# EAGLE design Ring machine1 copia (EAGLE 7.2.0)
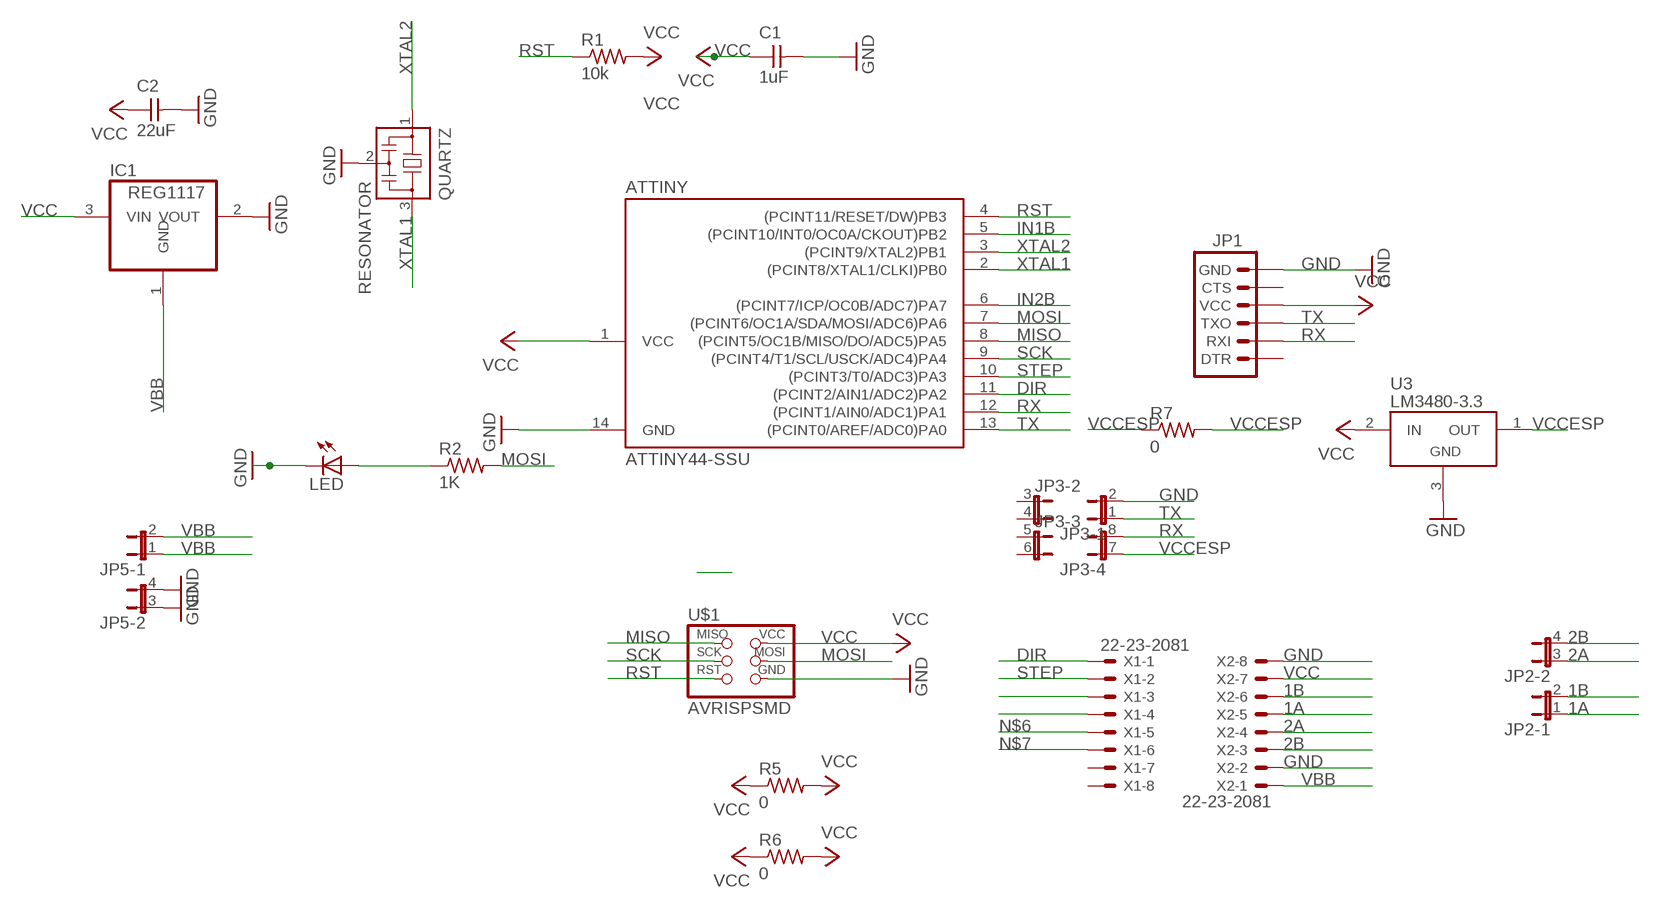
[diagram p0: schematic, sheet 1]

## Parts
ATTINY  ATTINY44-SSU  [SOIC14]
C1  1uF  UNPOLARIZED_CAPACITOR1206  [1206]
C2  22uF  UNPOLARIZED_CAPACITOR1206  [1206]
IC1  REG1117  [SOT223]
JP1  ARDUINO_SERIAL_PROGRAMLONGPADS  [1X06_LONGPADS]
JP2  JP2QE  [JP2Q]
JP3  JP4QE  [JP4Q]
JP5  JP2QE  [JP2Q]
LED  LED1206  [1206]
QUARTZ  RESONATOR  [EFOBM]
R1  10k  RESISTOR1206  [1206]
R2  1K  RESISTOR1206  [1206]
R5  0  RESISTOR1206  [1206]
R6  0  RESISTOR1206  [1206]
R7  0  RESISTOR1206  [1206]
U3  LM3480-3.3  [SOT-23-3]
U$1  AVRISPSMD  [2X03SMD]
X1  22-23-2081  [22-23-2081]
X2  22-23-2081  [22-23-2081]

## Nets
1A: JP2.1 X2.5
1B: JP2.2 X2.6
2A: JP2.3 X2.4
2B: JP2.4 X2.3
DIR: ATTINY.11((PCINT2/AIN1/ADC2)PA2) X1.1
GND: ATTINY.14(GND) C1.2 C2.2 IC1.2(VOUT) JP1.6(GND) JP3.2 JP5.3 JP5.4 LED.2(C) QUARTZ.2 U3.3(GND) U$1.6(GND) X2.2 X2.8
IN1B: ATTINY.5((PCINT10/INT0/OC0A/CKOUT)PB2)
IN2B: ATTINY.6((PCINT7/ICP/OC0B/ADC7)PA7)
LEDRES: LED.1(A) R2.1
MISO: ATTINY.8((PCINT5/OC1B/MISO/DO/ADC5)PA5) U$1.1(MISO)
MOSI: ATTINY.7((PCINT6/OC1A/SDA/MOSI/ADC6)PA6) R2.2 U$1.4(MOSI)
N$4: X1.3
N$5: X1.4
N$6: X1.5
N$7: X1.6
RST: ATTINY.4((PCINT11/RESET/DW)PB3) R1.1 U$1.5(RST)
RX: ATTINY.12((PCINT1/AIN0/ADC1)PA1) JP1.2(RXI) JP3.8
SCK: ATTINY.9((PCINT4/T1/SCL/USCK/ADC4)PA4) U$1.3(SCK)
STEP: ATTINY.10((PCINT3/T0/ADC3)PA3) X1.2
TX: ATTINY.13((PCINT0/AREF/ADC0)PA0) JP1.3(TXO) JP3.1
VBB: IC1.1(GND) JP5.1 JP5.2 X2.1
VCC: ATTINY.1(VCC) C1.1 C2.1 IC1.3(VIN) JP1.4(VCC) R1.2 R5.1 R5.2 R6.1 R6.2 U3.2(IN) U$1.2(VCC) X2.7
VCCESP: JP3.7 R7.1 R7.2 U3.1(OUT)
XTAL1: ATTINY.2((PCINT8/XTAL1/CLKI)PB0) QUARTZ.3
XTAL2: ATTINY.3((PCINT9/XTAL2)PB1) QUARTZ.1
Unconnected: JP1.1(DTR) JP1.5(CTS) JP3.3 JP3.4 JP3.5 JP3.6 X1.7 X1.8

## Library data of the parts
ATTINY = fab:ATTINY44
C1 C2 = FAB_Hello:UNPOLARIZED_CAPACITOR: unpolarized_capacitor
IC1 = burr-brown:REG1117: 800mA and 1A Low Dropout (LDO) Positive Regulator 1.8V, 2.5V, 2.85V, 3.3V, 5V, and Adj; MPN: REG1117; OC_FARNELL: 1097566; OC_NEWARK: 14P6981
JP1 = SparkFun-Connectors:ARDUINO_SERIAL_PROGRAM: FTDI connector footprints
JP2 JP5 = jumper:JP2QE: JUMPER
JP3 = jumper:JP4QE: JUMPER
LED = ng:LED
QUARTZ = fab:RESONATOR
R1 R2 R5-R7 = ng:RESISTOR
U3 = regulators:LM3480-*: National Semiconductor LM3480 100 mA, SOT-23, quasi-LDO linear regulator
U$1 = fab:AVRISP
X1 X2 = con-molex:22-23-2081: .100" (2.54mm) Center Header - 8 Pin; MF: MOLEX; MPN: 22-23-2081; OC_FARNELL: 1756826; OC_NEWARK: 01C7592

## Board
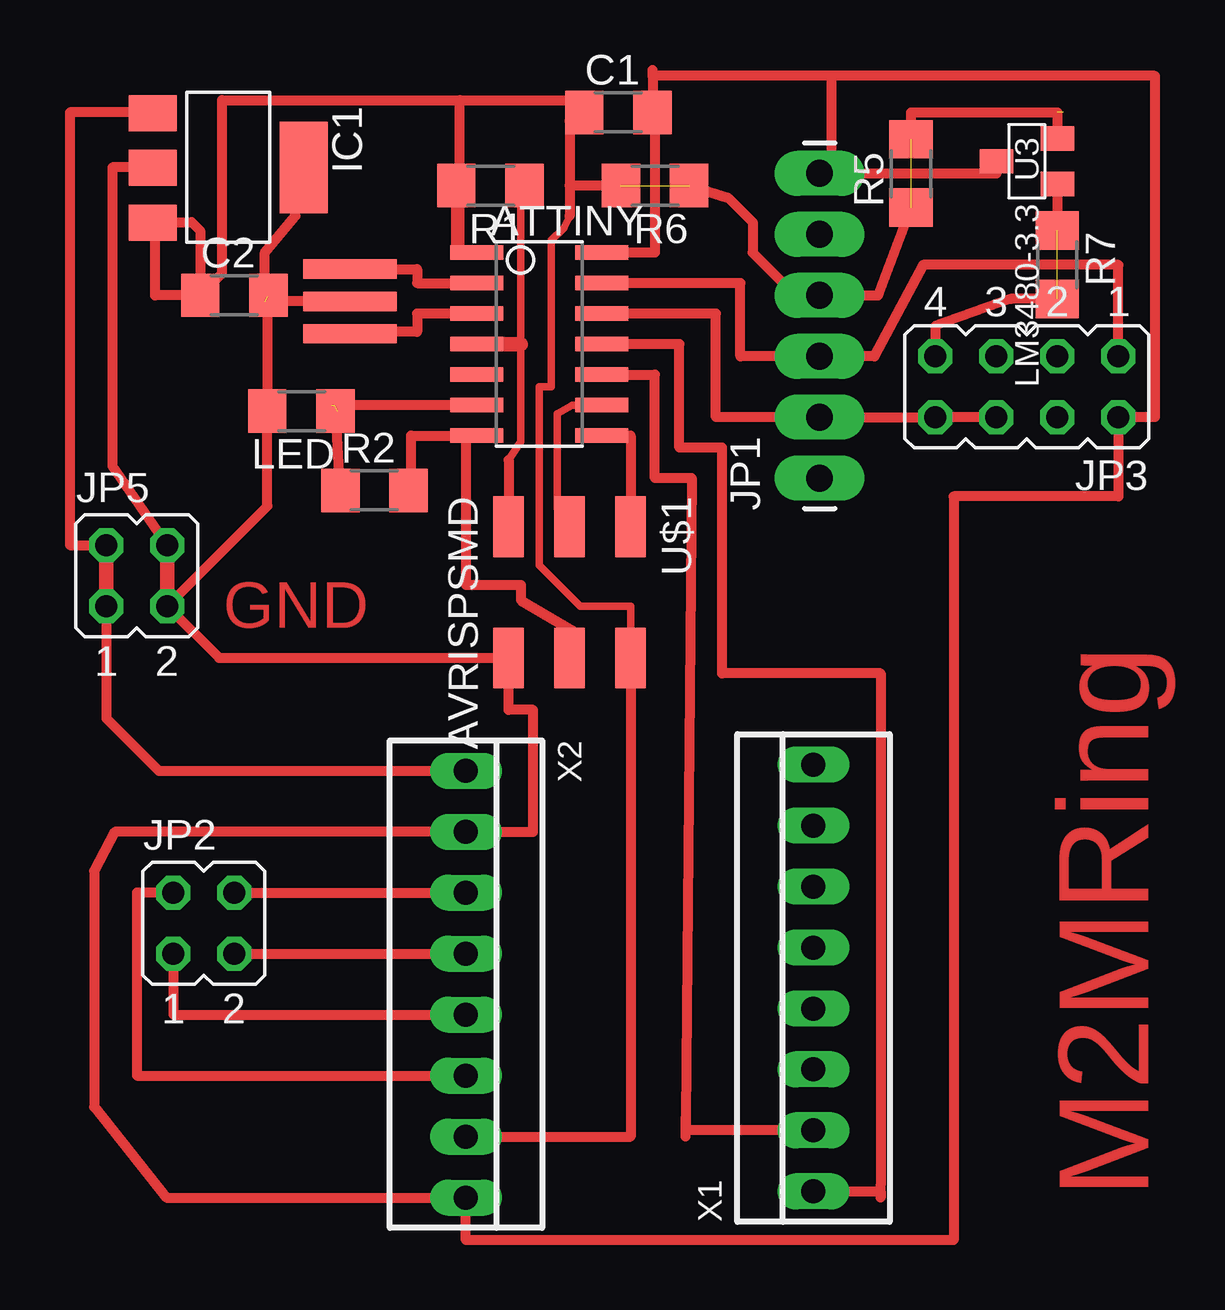
[diagram p1: board, top side]
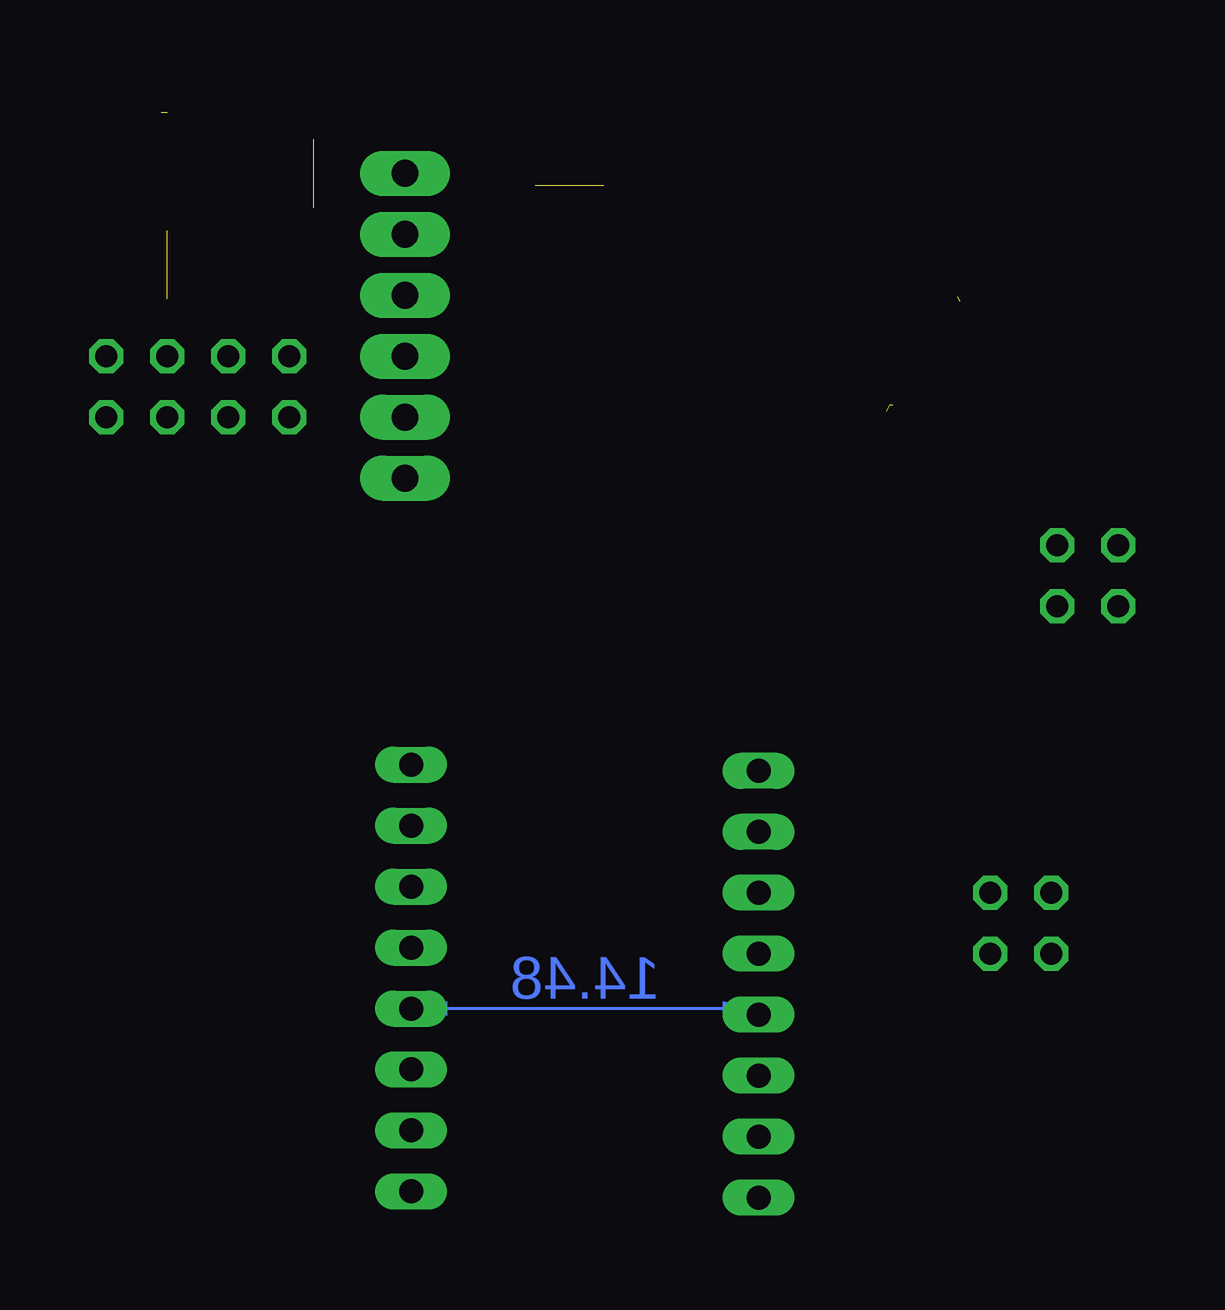
[diagram p2: board, bottom side, seen from below]

No outline drawn. Coordinates in mm, seen from the top.
Copper layers (1*16): Top 0.035mm / dielectric 1.5mm / Bottom 0.035mm
Design rules "default": minimum track width 10mil, minimum drill 24mil, track to track 8mil, track to pad 8mil, pad to pad 8mil, via to via 8mil, smd to smd 8mil, copper to edge 40mil, drill to drill 8mil, minimum pad ring 10mil, minimum via ring 8mil, stop-mask expansion 4mil, vias tented up to drill 0mil, thermal gap 10mil

### Footprints (pad centres in the part's own frame; a part is rotated, then mirrored left to right if it is on the bottom)
SOIC14 = smd 0.61 x 2.21: 1 -3.81,-2.603; 2 -2.54,-2.603; 3 -1.27,-2.603; 4 0,-2.603; 5 1.27,-2.603; 6 2.54,-2.603; 7 3.81,-2.603; 8 3.81,2.603; 9 2.54,2.603; 10 1.27,2.603; 11 0,2.603; 12 -1.27,2.603; 13 -2.54,2.603; 14 -3.81,2.603
1206 = smd 1.6 x 1.803: 1 -1.422,0; 2 1.422,0
SOT223 = smd 1.499 x 2.007: 1 -2.261,-3.15; 2 0.025,-3.15; 3 2.311,-3.15 | smd 3.81 x 2.007: 4 0,3.15
1X06_LONGPADS = drill 1.118 pad 1.88 long: 1 0,0; 2 2.54,0; 3 5.08,0; 4 7.62,0; 5 10.16,0; 6 12.7,0
JP2Q = drill 0.914 octagon: 1 -1.27,-1.27; 2 -1.27,1.27; 3 1.27,-1.27; 4 1.27,1.27
JP4Q = drill 0.914 octagon: 1 -3.81,-1.27; 2 -3.81,1.27; 3 -1.27,-1.27; 4 -1.27,1.27; 5 1.27,-1.27; 6 1.27,1.27; 7 3.81,-1.27; 8 3.81,1.27
EFOBM = smd 0.8 x 3.9: 1 -1.35,0; 2 0,0; 3 1.35,0
SOT-23-3 = smd 1.016 x 1.397: 1 -0.953,-1.27; 2 0.953,-1.27; 3 0,1.27
2X03SMD = smd 2.54 x 1.27: 1 -2.54,2.54; 2 2.92,2.54; 3 -2.54,0; 4 2.92,0; 5 -2.54,-2.54; 6 2.92,-2.54
22-23-2081 = drill 1 long: 1 -8.89,0; 2 -6.35,0; 3 -3.81,0; 4 -1.27,0; 5 1.27,0; 6 3.81,0; 7 6.35,0; 8 8.89,0

### Placement (x,y rotation side)
ATTINY  30.48,49.28 270 top
C1  33.78,58.93 0 top
C2  17.78,51.31 0 top
IC1  17.53,56.64 270 top
JP1  42.16,43.69 90 top
JP2  16.51,25.15 0 top
JP3  50.8,47.5 180 top
JP5  13.72,39.62 0 top
LED  20.57,46.48 180 top
QUARTZ  22.61,51.05 90 top
R1  28.45,55.88 180 top
R2  23.62,43.18 0 top
R5  45.97,56.39 90 top
R6  35.31,55.88 180 top
R7  52.07,52.58 270 top
U3  50.8,56.9 90 top
U$1  31.75,39.12 270 top
X1  41.91,22.86 90 top
X2  27.43,22.61 270 top

### Tracks (layer width: path | path; a pad name or v marks a point on that pad's centre or on a via)
1A
  Top 0.406: JP2.1 15.24,21.34 X2.5
1B
  Top 0.406: JP2.2 13.72,26.42 13.72,18.8 X2.6
2A
  Top 0.406: JP2.3 X2.4
2B
  Top 0.406: JP2.4 X2.3
DIR
  Top 0.406: ATTINY.11 36.32,49.28 36.32,44.96 38.1,44.96 38.1,35.56 44.7,35.56 44.7,14.22 44.7,13.97 | 44.7,13.97 44.7,13.72 | X1.1 44.7,13.97
GND  (1 unrouted)
  Top 0.406: 35.2,59.59 C1.2 | QUARTZ.2 19.05,51.05 19.05,53.09 20.32,54.61 20.32,56.9 | IC1.2 14.35,56.64 12.7,56.64 12.7,44.2 JP5.4 | C2.2 19.15,51.26 LED.2 19.15,42.52 JP5.3 17.14,36.2 U$1.6 29.21,34.04 30.23,34.04 30.23,28.96 X2.2 12.8,28.96 11.94,27.33 11.94,17.49 14.95,13.72 X2.8 27.43,11.94 47.75,11.94 47.75,42.93 54.61,42.93 JP3.2 56.13,46.23 56.13,60.45 42.67,60.45 | C1.2 35.31,59.08 35.31,53.09 ATTINY.14 | U3.3 49.53,56.39 JP1.6 42.67,56.39 42.67,60.45 | 35.2,60.45 C1.2 | 42.67,60.45 35.2,60.45 | 35.2,60.45 35.2,60.71
  Top 0.61: JP5.3 JP5.4
IN2B  (2 unrouted)
  Top 0.406: ATTINY.6 21.84,46.74 | 21.59,46.74 21.84,46.74 | 21.84,46.74 21.84,46.48 22.1,46.48
LEDRES
  Top 0.406: R2.1 LED.1
MISO
  Top 0.406: ATTINY.8 34.29,45.47 U$1.1
MOSI
  Top 0.406: U$1.4 31.75,35.35 31.79,36.07 31.87,37.34 29.72,38.61 29.72,39.24 27.43,39.24 27.43,45.47 ATTINY.7 25.15,45.47 25.15,43.28 R2.2
RST
  Top 0.305: 29.72,55.88 29.72,49.28 29.72,45.21 29.21,44.45
  Top 0.406: R1.1 29.72,55.88 | 29.21,44.45 U$1.5
  Top 0.61: ATTINY.4 29.72,49.28
RX
  Top 0.406: ATTINY.12 37.85,50.55 37.85,46.23 JP1.2 JP3.8 48.77,46.23
SCK
  Top 0.305: ATTINY.9 31.86,46.74 31.24,46.38 31.24,42.42 U$1.3
STEP
  Top 0.406: ATTINY.10 35.31,48.01 35.31,43.69 36.83,43.69 36.58,17.02 | 36.58,17.02 36.58,16.26 | X1.2 36.58,16.51 36.58,17.02
TX
  Top 0.406: ATTINY.13 38.86,51.82 38.86,48.77 JP1.3 44.45,48.77 46.48,52.58 54.61,52.58 JP3.1
VBB
  Top 0.406: IC1.1 14.35,58.93 10.92,58.93 10.92,40.89 JP5.2 | JP5.1 12.45,33.68 14.63,31.5 X2.1
  Top 0.61: JP5.2 JP5.1
VCC  (3 unrouted)
  Top 0.305: U$1.2 34.29,38.35 32.18,38.35 30.48,40.06 30.48,47.5 30.99,47.5 30.99,53.59 31.5,54.1 31.75,54.61
  Top 0.406: 27.03,53.09 ATTINY.1 | 27.03,53.09 R1.2 | R5.1 44.6,51.31 JP1.4 41.15,51.31 39.37,53.09 39.37,54.36 38.35,55.37 R6.1 | X2.7 34.29,16.26 U$1.2 | IC1.3 14.4,54.36 14.48,54.36 | 14.48,54.36 16,54.36 16.36,54 C2.1 17.27,52.22 17.27,59.44 27.18,59.44 | 31.75,55.88 31.75,58.57 C1.1 32.26,59.18 32,59.44 27.18,59.44 | 31.75,55.88 31.75,54.61 | R6.2 31.75,55.88 | 27.03,53.09 27.18,53.24 27.18,59.44 | 16.26,51.31 14.48,51.31 14.48,54.36 | R5.2 45.97,58.93 52.07,58.93 U3.2
VCCESP  (1 unrouted)
  Top 0.406: U3.1 R7.1 | R7.2 50.14,51.16 46.99,50.04 JP3.7
XTAL1
  Top 0.406: QUARTZ.3 25.4,52.4 25.4,51.82 ATTINY.2
XTAL2
  Top 0.406: ATTINY.3 25.4,50.55 25.4,49.78 23.62,49.78 QUARTZ.1
(copper drawn outside any net)
  shapes: Bottom area x1

### Text on the board
Top: GND | M2MRing